# Altium schematic sheet PowerGnd.SchDoc
size A4; SheetNumber: 3; SheetTotal: 4
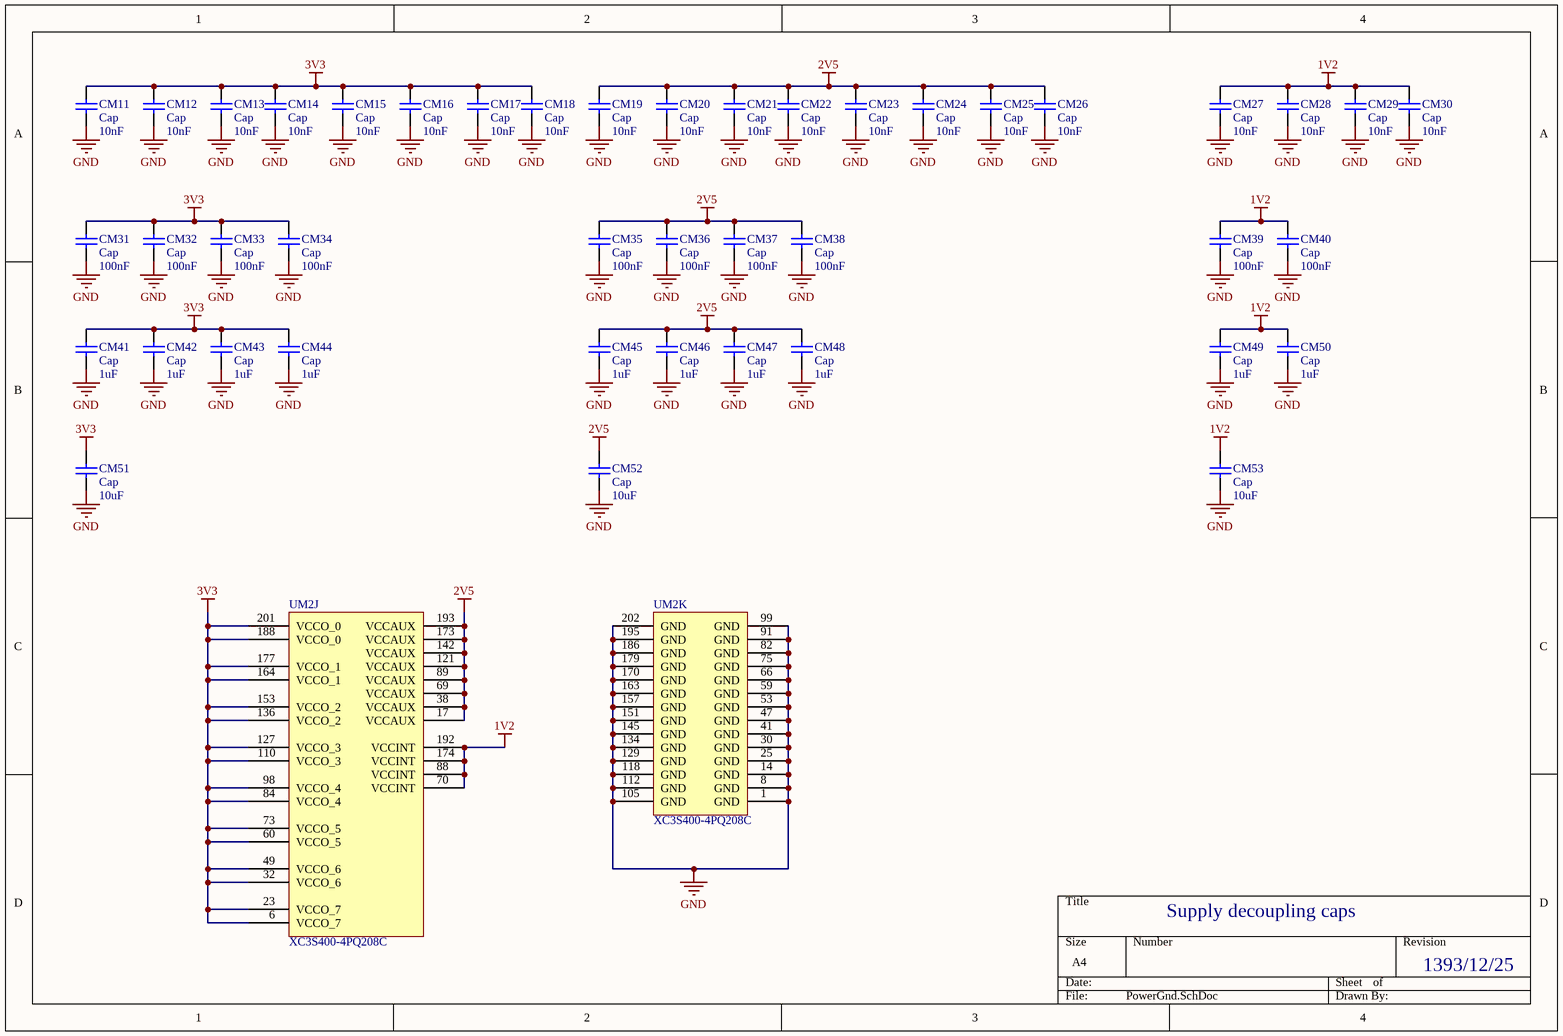
[diagram p0: PowerGnd.SchDoc]

## Parts
CM11  Cap  value 10nF  [C0805]
CM12  Cap  value 10nF  [C0805]
CM13  Cap  value 10nF  [C0805]
CM14  Cap  value 10nF  [C0805]
CM15  Cap  value 10nF  [C0805]
CM16  Cap  value 10nF  [C0805]
CM17  Cap  value 10nF  [C0805]
CM18  Cap  value 10nF  [C0805]
CM19  Cap  value 10nF  [C0805]
CM20  Cap  value 10nF  [C0805]
CM21  Cap  value 10nF  [C0805]
CM22  Cap  value 10nF  [C0805]
CM23  Cap  value 10nF  [C0805]
CM24  Cap  value 10nF  [C0805]
CM25  Cap  value 10nF  [C0805]
CM26  Cap  value 10nF  [C0805]
CM27  Cap  value 10nF  [C0805]
CM28  Cap  value 10nF  [C0805]
CM29  Cap  value 10nF  [C0805]
CM30  Cap  value 10nF  [C0805]
CM31  Cap  value 100nF  [C0805]
CM32  Cap  value 100nF  [C0805]
CM33  Cap  value 100nF  [C0805]
CM34  Cap  value 100nF  [C0805]
CM35  Cap  value 100nF  [C0805]
CM36  Cap  value 100nF  [C0805]
CM37  Cap  value 100nF  [C0805]
CM38  Cap  value 100nF  [C0805]
CM39  Cap  value 100nF  [C0805]
CM40  Cap  value 100nF  [C0805]
CM41  Cap  value 1uF  [C0805]
CM42  Cap  value 1uF  [C0805]
CM43  Cap  value 1uF  [C0805]
CM44  Cap  value 1uF  [C0805]
CM45  Cap  value 1uF  [C0805]
CM46  Cap  value 1uF  [C0805]
CM47  Cap  value 1uF  [C0805]
CM48  Cap  value 1uF  [C0805]
CM49  Cap  value 1uF  [C0805]
CM50  Cap  value 1uF  [C0805]
CM51  Cap  value 10uF  [C0805]
CM52  Cap  value 10uF  [C0805]
CM53  Cap  value 10uF  [C0805]
UM2  XC3S400-4PQ208C  [PQ208_N]  (parts J,K of 11)

## Nets
1V2: CM27.2 CM28.2 CM29.2 CM30.2 CM39.2 CM40.2 CM49.2 CM50.2 CM53.2 UM2.70(VCCINT) UM2.88(VCCINT) UM2.174(VCCINT) UM2.192(VCCINT)
2V5: CM19.2 CM20.2 CM21.2 CM22.2 CM23.2 CM24.2 CM25.2 CM26.2 CM35.2 CM36.2 CM37.2 CM38.2 CM45.2 CM46.2 CM47.2 CM48.2 CM52.2 UM2.17(VCCAUX) UM2.38(VCCAUX) UM2.69(VCCAUX) UM2.89(VCCAUX) UM2.121(VCCAUX) UM2.142(VCCAUX) UM2.173(VCCAUX) UM2.193(VCCAUX)
3V3: CM11.2 CM12.2 CM13.2 CM14.2 CM15.2 CM16.2 CM17.2 CM18.2 CM31.2 CM32.2 CM33.2 CM34.2 CM41.2 CM42.2 CM43.2 CM44.2 CM51.2 UM2.6(VCCO_7) UM2.23(VCCO_7) UM2.32(VCCO_6) UM2.49(VCCO_6) UM2.60(VCCO_5) UM2.73(VCCO_5) UM2.84(VCCO_4) UM2.98(VCCO_4) UM2.110(VCCO_3) UM2.127(VCCO_3) UM2.136(VCCO_2) UM2.153(VCCO_2) UM2.164(VCCO_1) UM2.177(VCCO_1) UM2.188(VCCO_0) UM2.201(VCCO_0)
GND: CM11.1 CM12.1 CM13.1 CM14.1 CM15.1 CM16.1 CM17.1 CM18.1 CM19.1 CM20.1 CM21.1 CM22.1 CM23.1 CM24.1 CM25.1 CM26.1 CM27.1 CM28.1 CM29.1 CM30.1 CM31.1 CM32.1 CM33.1 CM34.1 CM35.1 CM36.1 CM37.1 CM38.1 CM39.1 CM40.1 CM41.1 CM42.1 CM43.1 CM44.1 CM45.1 CM46.1 CM47.1 CM48.1 CM49.1 CM50.1 CM51.1 CM52.1 CM53.1 UM2.1(GND) UM2.8(GND) UM2.14(GND) UM2.25(GND) UM2.30(GND) UM2.41(GND) UM2.47(GND) UM2.53(GND) UM2.59(GND) UM2.66(GND) UM2.75(GND) UM2.82(GND) UM2.91(GND) UM2.99(GND) UM2.105(GND) UM2.112(GND) UM2.118(GND) UM2.129(GND) UM2.134(GND) UM2.145(GND) UM2.151(GND) UM2.157(GND) UM2.163(GND) UM2.170(GND) UM2.179(GND) UM2.186(GND) UM2.195(GND) UM2.202(GND)

## Notes on the sheet
- Supply decoupling caps
- 1393/12/25

## Library data of the parts
CM11-CM53 = Cap: Capacitor; Published: 8-Jun-2000; LatestRevisionDate: 17-Jul-2002; LatestRevisionNote: Re-released for DXP Platform.; PackageReference: RAD-0.3; Publisher: Altium Limited; PackageDescription: Radial Cap, Thru-Hole; 2 Leads; 0.3 in Pin Spacing
UM2 = XC3S400-4PQ208C: Spartan-3 1.2V FPGA, 141 User I/Os, 208-Pin PQFP, Standard Performance, Commercial Grade; OrderingInformation: Additional code may have to be appended for different mask revision devices.; Published: 17-Sep-2003; LatestRevisionDate: 01-Mar-2010; LatestRevisionNote: Updated to datasheet version 2.5 Dec-2009.; DatasheetVersion: ver2.5, Dec-2009; PackageVersion: ver1.2, Jun-2004; PackageReference: PQ208; Publisher: Altium Limited; PackageDescription: 208-Pin Plastic Quad Flat Pack (PQ208); Supplier 1: Digi-Key; Supplier Part Number 1: XC3S400-4PQ208C-ND; Code_JEDEC: MS-029-FA-1; ComponentLink1Description: Spartan-3 Datasheet; ComponentLink1URL: http://www.xilinx.com/support/documentation/data_sheets/ds099.pdf; ComponentLink2Description: PQ208 Package Drawing; ComponentLink2URL: http://www.xilinx.com/support/documentation/package_specs/pq208.pdf; ComponentLink3Description: Spartan-3 Documents; ComponentLink3URL: http://www.xilinx.com/support/documentation/spartan-3.htm; ComponentLink4Description: Xilinx.com Home; ComponentLink4URL: http://www.xilinx.com